# EAGLE design band psd v1.1 shield (EAGLE 7.1.0)
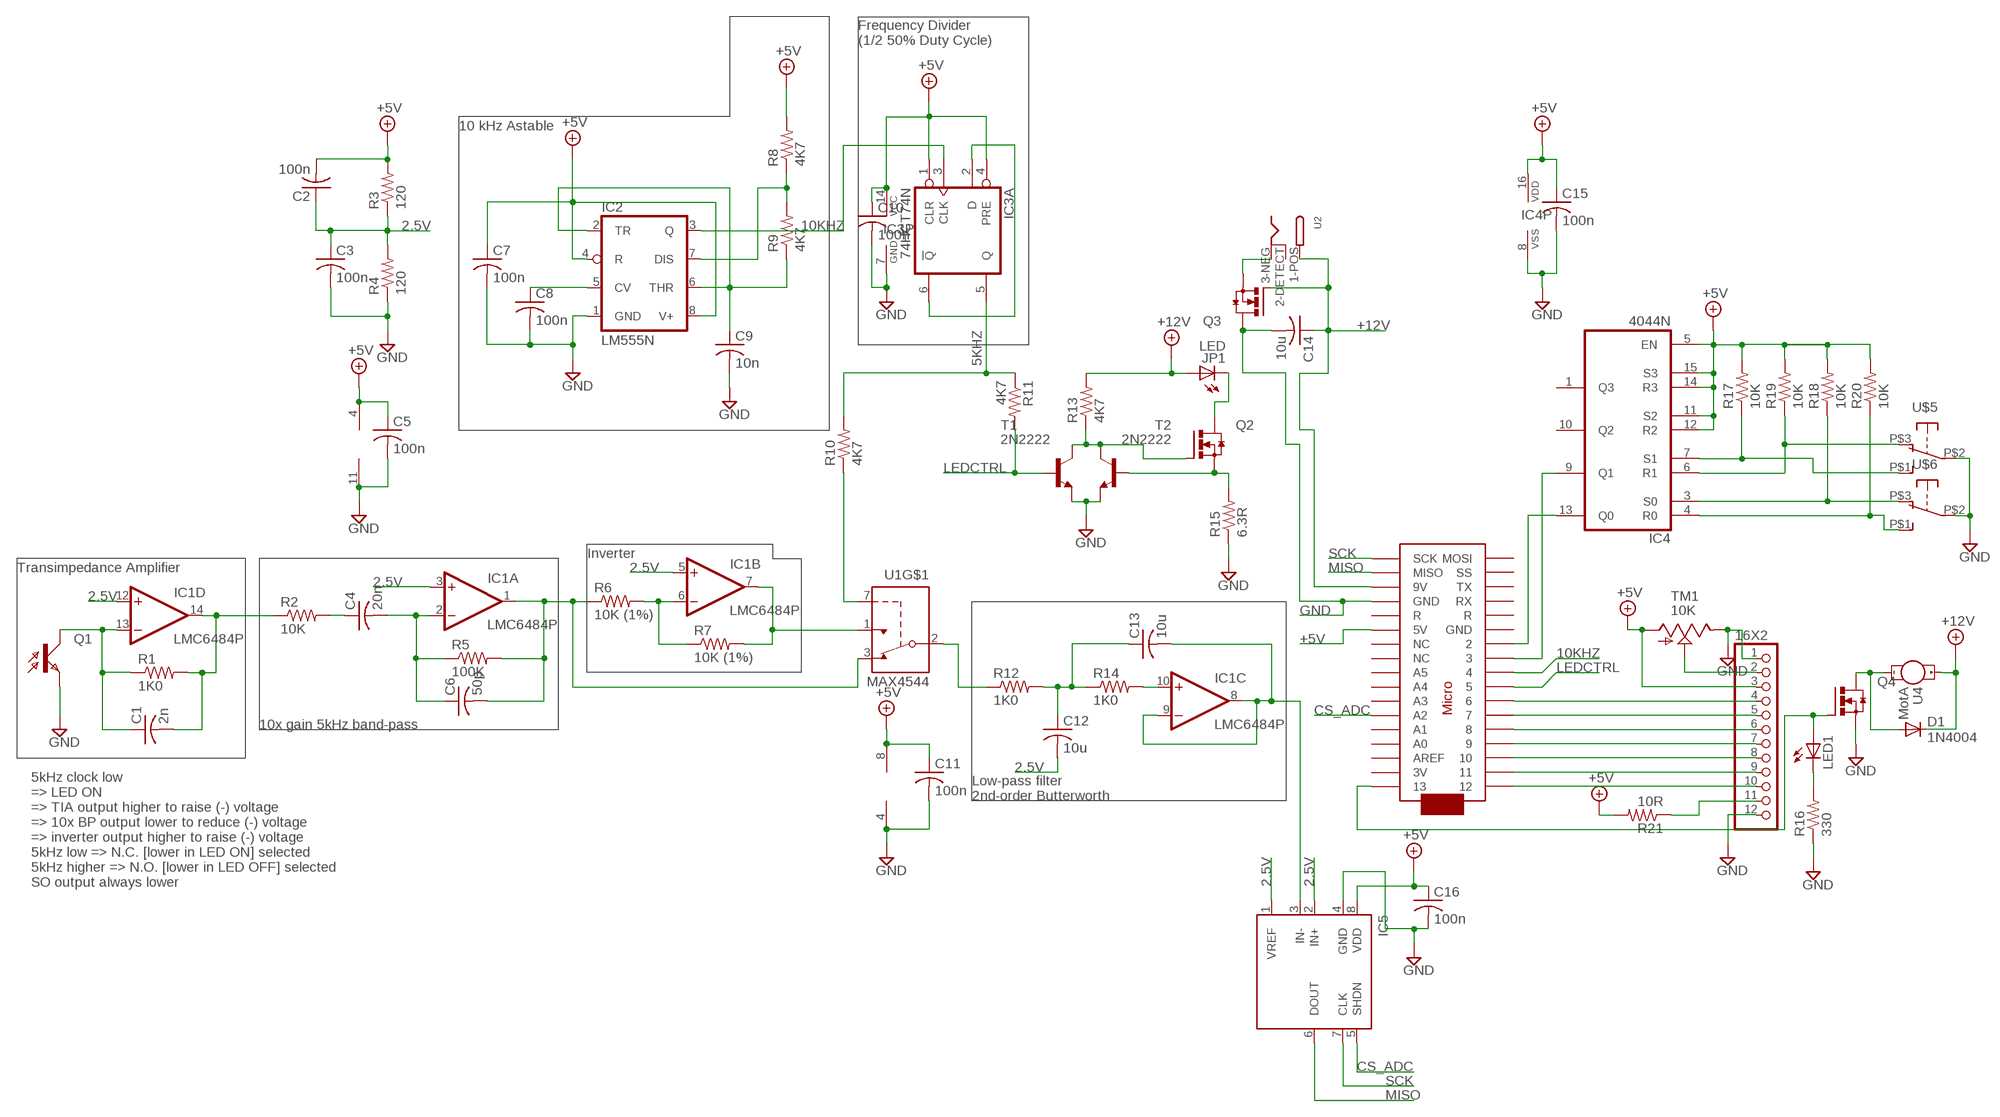
[diagram p0: schematic, sheet 1]

## Parts
16X2  PINHD-1X12-CB  [1X12-CB]
C1  2n  C-US025-025X050  [C025-025X050]
C2  100n  C-US025-025X050  [C025-025X050]
C3  100n  C-US025-025X050  [C025-025X050]
C4  20n  C-US025-025X050  [C025-025X050]
C5  100n  C-US025-025X050  [C025-025X050]
C6  50p  C-US025-025X050  [C025-025X050]
C7  100n  C-US025-025X050  [C025-025X050]
C8  100n  C-US025-025X050  [C025-025X050]
C9  10n  C-US025-025X050  [C025-025X050]
C10  100n  C-US025-025X050  [C025-025X050]
C11  100n  C-US025-025X050  [C025-025X050]
C12  10u  C-US050-025X075  [C050-025X075]
C13  10u  C-US050-025X075  [C050-025X075]
C14  10u  C-US050-050X075  [C050-050X075]
C15  100n  C-US025-025X050  [C025-025X050]
C16  100n  C-US025-025X050  [C025-025X050]
D1  1N4004  [DO41-10]
IC1  LMC6484P  [DIL14]
IC2  LM555N  [DIL08]
IC3  74HCT74N  [DIL14]
IC4  4044N  [DIL16]
IC5  MCP3301  [DIL08]
JP1  LED  LED_CXN  [1X02_SCREW]
LED1  LED3MM  [LED3MM]
Q1  LTR-4206PTRANS  [PTRANS]
Q2  IRLB8721  [TO220BV]
Q3  IRLB8721  [TO220BV]
Q4  IRLB8721  [TO220BV]
R1  1K0  R-US_0204/2V  [0204V]
R2  10K  R-US_0204/2V  [0204V]
R3  120  R-US_0204/2V  [0204V]
R4  120  R-US_0204/2V  [0204V]
R5  100K  R-US_0204/2V  [0204V]
R6  10K (1%)  R-US_0204/2V  [0204V]
R7  10K (1%)  R-US_0204/2V  [0204V]
R8  4K7  R-US_0204/2V  [0204V]
R9  4K7  R-US_0204/2V  [0204V]
R10  4K7  R-US_0204/2V  [0204V]
R11  4K7  R-US_0204/2V  [0204V]
R12  1K0  R-US_0204/2V  [0204V]
R13  4K7  R-US_0204/2V  [0204V]
R14  1K0  R-US_0204/2V  [0204V]
R15  6.3R  R-US_0204/2V  [0204V]
R16  330  R-US_0204/2V  [0204V]
R17  10K  R-US_0204/2V  [0204V]
R18  10K  R-US_0204/2V  [0204V]
R19  10K  R-US_0204/2V  [0204V]
R20  10K  R-US_0204/2V  [0204V]
R21  10R  R-US_0204/2V  [0204V]
T1  2N2222  [TO92-EBC-OVAL]
T2  2N2222  [TO92-EBC-OVAL]
TM1  10K  TRIM_US-B25P  [B25P]
U1  MAX4544  [DIL08]
U2  DC-IN-PANEL  [3WIRES]
U3  ARDUINOMICRO  [ARDUINOMICRO]
U4  MotA  1X02_MOTOR  [1X02_SCREW]
U$5  APE1F-5M-10-Z  [APE1F-5M-10Z]
U$6  APE1F-5M-10-Z  [APE1F-5M-10Z]

## Nets
2.5V: C2.1 C3.1 C12.2 IC1.3(A:+IN) IC1.5(B:+IN) IC1.12(D:+IN) IC5.1(VREF) IC5.2(IN+) R3.1 R4.2
5KHZ: IC3.5(A:Q) R10.2 R11.1
10KHZ: IC2.3(Q) IC3.3(A:CLK) U3.P$9
+5V: 16X2.3 C2.2 C5.1 C7.1 C10.1 C11.1 C15.1 C16.1 IC1.4(P:V+) IC2.4(R) IC2.8(V+) IC3.1(A:CLR) IC3.4(A:PRE) IC3.14(P:VCC) IC4.5(EN) IC4.11(S2) IC4.12(R2) IC4.14(R3) IC4.15(S3) IC4.16(VDD) IC5.8(VDD) R3.2 R8.2 R17.2 R18.2 R19.2 R20.2 R21.2 TM1.A U1.8(V+) U3.P$23(5V)
+12V: C14.1 D1.C JP1.1/POS(A) Q3.G R13.2 U2.1-POS(PWR) U3.P$20(9V) U4.1/POS(+)
CS_ADC: IC5.5(SHDN) U3.P$29(A2)
GND: 16X2.1 16X2.12 C3.2 C5.2 C7.2 C8.2 C9.2 C10.2 C11.2 C14.2 C15.2 C16.2 IC1.11(P:V-) IC2.1(GND) IC3.7(P:GND) IC4.8(VSS) IC5.4(GND) Q1.A(E) Q3.D Q4.S R4.1 R15.1 R16.1 T1.E T2.E TM1.E U1.4(V-) U3.P$12(GND) U$5.P$2(COM) U$6.P$2(COM)
LEDCTRL: R11.2 T1.B U3.P$8
MISO: IC5.6(DOUT) U3.P$19(MISO)
N$1: C1.1 IC1.13(D:-IN) Q1.K(C) R1.1
N$2: C4.1 R2.2
N$3: D1.A Q4.D U4.2(-)
N$4: IC1.6(B:-IN) R6.2 R7.1
N$5: IC1.7(B:OUT) R7.2 U1.1(NO)
N$6: R12.1 U1.2(COM)
N$7: IC1.10(C:+IN) R14.2
N$8: Q2.G R13.1 T1.C T2.C
N$9: C9.1 IC2.2(TR) IC2.6(THR) R9.1
N$10: C8.1 IC2.5(CV)
N$11: 16X2.4 U3.P$7
N$12: IC3.2(A:D) IC3.6(A:!Q)
N$13: IC2.7(DIS) R8.1 R9.2
N$14: Q2.S R15.2 T2.B
N$15: 16X2.5 U3.P$6
N$16: LED1.K(C) R16.2
N$18: JP1.2(K) Q2.D
N$19: LED1.A Q4.G U3.P$34
N$20: 16X2.6 U3.P$5
N$21: 16X2.7 U3.P$4
N$22: C1.2 IC1.14(D:OUT) R1.2 R2.1
N$23: R10.1 U1.7(IN)
N$24: 16X2.8 U3.P$3
N$25: C4.2 C6.1 IC1.2(A:-IN) R5.1
N$26: C6.2 IC1.1(A:OUT) R5.2 R6.1 U1.3(NC)
N$27: C12.1 C13.1 R12.2 R14.1
N$28: C13.2 IC1.8(C:OUT) IC1.9(C:-IN) IC5.3(IN-)
N$29: 16X2.9 U3.P$2
N$30: 16X2.10 U3.P$1
N$31: IC4.9(Q1) U3.P$10
N$32: IC4.13(Q0) U3.P$11
N$33: IC4.7(S1) R17.1 U$5.P$1(NO)
N$34: IC4.6(R1) R19.1 U$5.P$3(NC)
N$36: IC4.3(S0) R18.1 U$6.P$3(NC)
N$37: IC4.4(R0) R20.1 U$6.P$1(NO)
N$38: 16X2.2 TM1.S
N$41: 16X2.11 R21.1
N$47: Q3.S U2.3-NEG(GND)
SCK: IC5.7(CLK) U3.P$18(SCK)
Unconnected: IC3.8(B:!Q) IC3.9(B:Q) IC3.10(B:PRE) IC3.11(B:CLK) IC3.12(B:D) IC3.13(B:CLR) IC4.1(Q3) IC4.10(Q2) U3.P$13(R) U3.P$14(RX) U3.P$15(TX) U3.P$16(SS) U3.P$17(MOSI) U3.P$21(GND) U3.P$22(R) U3.P$24(NC) U3.P$25(NC) U3.P$26(A5) U3.P$27(A4) U3.P$28(A3) U3.P$30(A1) U3.P$31(A0) U3.P$32(AREF) U3.P$33(3V)

## Notes on the sheet
- Frequency Divider
  (1/2 50% Duty Cycle)
- 10 kHz Astable
- Inverter
- Transimpedance Amplifier
- 10x gain 5kHz band-pass
- 5kHz clock low
  => LED ON
  => TIA output higher to raise (-) voltage
  => 10x BP output lower to reduce (-) voltage
  => inverter output higher to raise (-) voltage
  5kHz low => N.C. [lower in LED ON] selected
  5kHz higher => N.O. [lower in LED OFF] selected
  SO output always lower
- Low-pass filter
  2nd-order Butterworth

## Power pins joined to a net without a drawn wire
GNDBREAK: U2.2-DETECT(GNDBREAK)

## Library data of the parts
16X2 = adafruit:PINHD-1X12: PIN HEADER
C1-C16 = adafruit:C-US: CAPACITOR, American symbol
D1 = adafruit:1N4004: DIODE General purpose 1N400x type rectifier (With bigger pads) http://www.ladyada.net/library/pcb/eaglelibrary.html
IC1 = ingolia:LMC6484: SoundPLUS (TM) High Performance AUDIO OPERATIONAL AMPLIFIERS Source: http://focus.ti.com/lit/ds/sbos058/sbos058.pdf
IC2 = linear:*555: TIMER
IC3 = 74xx-eu:74*74: Dual D type positive edge triggered FLIP FLOP, preset and clear
IC4 = 40xx:4044: Quad 3-state NAND R/S LATCH
IC5 = ingolia:MCP3301
JP1 = ingolia:LED_CXN
LED1 = adafruit:LED: LED OSRAM: - CHIPLED LG R971, LG N971, LY N971, LG Q971, LY Q971, LO R971, LY R971 LH N974, LH R974 LS Q976, LO Q976, LY Q976 LO Q996 - Hyper CHIPLED LW Q18S LB Q993, LB Q99A, LB R99A - SideLED LS A670, LO A670, LY A670, LG A670, LP A670 LB A673, LV A673, LT A673, LW A673 LH A674 LY A675 LS A676, LA A676, LO A676, LY A676, LW A676 LS A679, LY A679, LG A679 - Hyper Micro SIDELED® LS Y876, LA Y876, LO Y876, LY Y876 LT Y87S - SmartLED LW L88C, LW L88S LB L89C, LB L89S, LG L890 LS L89K, LO L89K, LY L89K LS L896, LA L896, LO L896, LY L896 - TOPLED LS T670, LO T670, LY T670, LG T670, LP T670 LSG T670, LSP T670, LSY T670, LOP T670, LYG T670 LG T671, LOG T671, LSG T671 LB T673, LV T673, LT T673, LW T673 LH T674 LS T676, LA T676, LO T676, LY T676, LB T676, LH T676, LSB T676, LW T676 LB T67C, LV T67C, LT T67C, LS T67K, LO T67K, LY T67K, LW E67C LS E67B, LA E67B, LO E67B, LY E67B, LB E67C, LV E67C, LT E67C LW T67C LS T679, LY T679, LG T679 LS T770, LO T770, LY T770, LG T770, LP T770 LB T773, LV T773, LT T773, LW T773 LH T774 LS E675, LA E675, LY E675, LS T675 LS T776, LA T776, LO T776, LY T776, LB T776 LHGB T686 LT T68C, LB T68C - Hyper Mini TOPLED® LB M676 - Mini TOPLED Santana® LG M470 LS M47K, LO M47K, LY M47K Source: http://www.osram.convergy.de/
Q1 = ingolia:LTR-4206
Q2-Q4 = ingolia:IRLB8721
R1-R21 = adafruit:R-US_: RESISTOR, American symbol
T1 T2 = adafruit:2N2222: NPN TRANSISTOR Big oval pads
TM1 = pot:TRIM_US-: POTENTIOMETER
U1 = ingolia:MAX4544
U2 = ingolia:DC-IN-PANEL
U3 = adafruit:ARDUINOMICRO
U4 = ingolia:1X02_MOTOR
U$5 U$6 = ingolia:APE1F-5M-10-Z

## Board
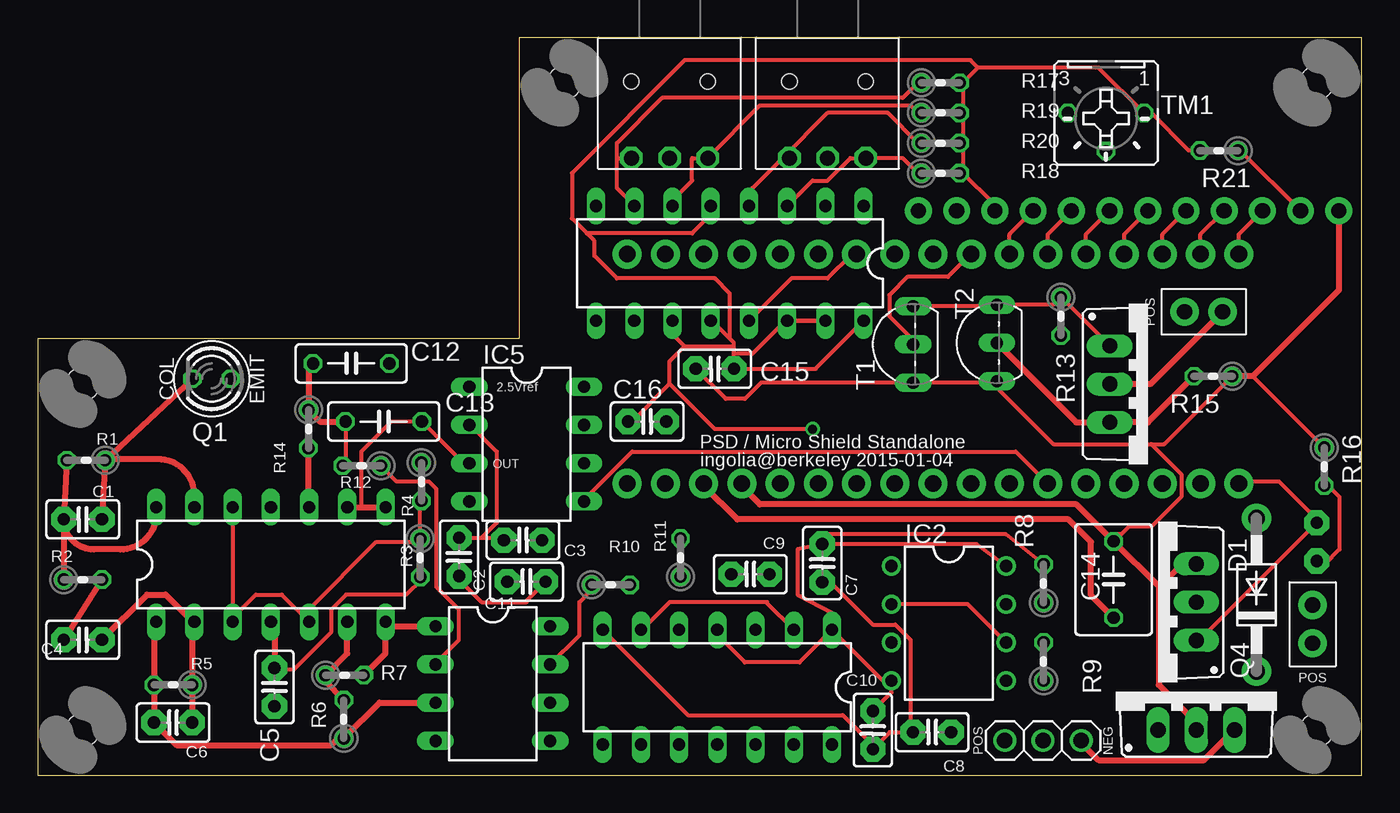
[diagram p1: board, top side]
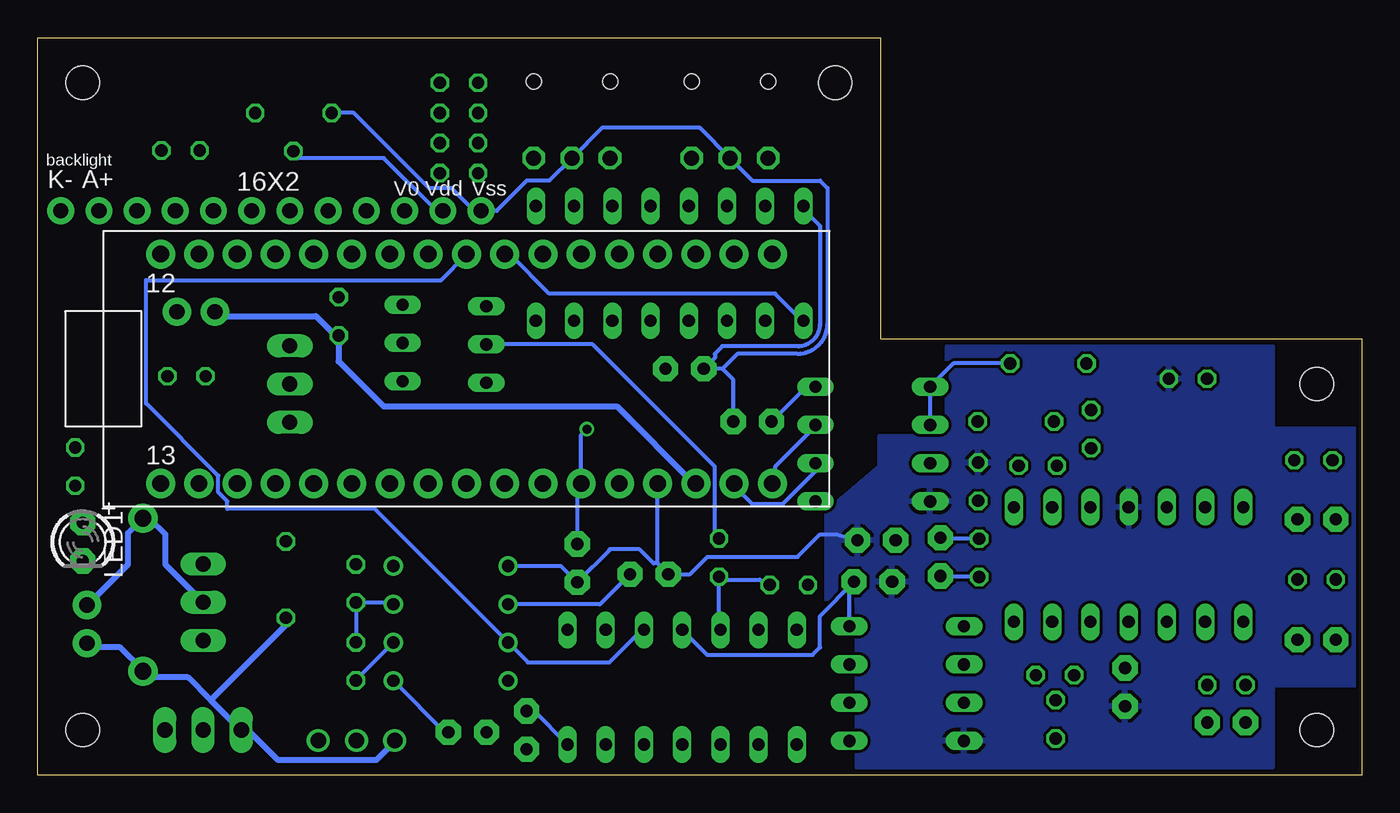
[diagram p2: board, bottom side, seen from below]

Size 88 x 49 mm. Coordinates in mm from the lower left corner, seen from the top.
Outline: 0,0 88,0 88,49 32,49 32,29 0,29 0,0
Copper layers (1*16): Top 0.0356mm / dielectric 1.5011mm / Bottom 0.0356mm
Design rules "OSHPark-LaenPCBOrder": minimum track width 6mil, minimum drill 13mil, track to track 6mil, track to pad 6mil, pad to pad 6mil, via to via 6mil, smd to smd 6mil, copper to edge 15mil, drill to drill 6mil, minimum pad ring 7mil, minimum via ring 7mil, stop-mask expansion 3mil, vias tented up to drill 0mil, thermal gap 10mil
tKeepout: area 6.5,21 to 16.5,29

### Footprints (pad centres in the part's own frame; a part is rotated, then mirrored left to right if it is on the bottom)
1X12-CB = drill 1.016 pad 1.778: 1 -13.97,0; 2 -11.43,0; 3 -8.89,0; 4 -6.35,0; 5 -3.81,0; 6 -1.27,0; 7 1.27,0; 8 3.81,0; 9 6.35,0; 10 8.89,0; 11 11.43,0; 12 13.97,0
C025-025X050 = drill 0.813 pad 1.676 octagon: 1 -1.27,0; 2 1.27,0
C050-025X075 = drill 0.813 octagon: 1 -2.54,0; 2 2.54,0
C050-050X075 = drill 0.813 octagon: 1 -2.54,0; 2 2.54,0
DO41-10 = drill 1.118 pad 1.93: A 5.08,0; C -5.08,0
DIL14 = drill 0.813 long: 1 -7.62,-3.81; 2 -5.08,-3.81; 3 -2.54,-3.81; 4 0,-3.81; 5 2.54,-3.81; 6 5.08,-3.81; 7 7.62,-3.81; 8 7.62,3.81; 9 5.08,3.81; 10 2.54,3.81; 11 0,3.81; 12 -2.54,3.81; 13 -5.08,3.81; 14 -7.62,3.81
DIL08 = drill 0.813 pad 1.27: 1 -3.81,-3.81; 2 -1.27,-3.81; 3 1.27,-3.81; 4 3.81,-3.81; 5 3.81,3.81; 6 1.27,3.81; 7 -1.27,3.81; 8 -3.81,3.81
DIL16 = drill 0.813 long: 1 -8.89,-3.81; 2 -6.35,-3.81; 3 -3.81,-3.81; 4 -1.27,-3.81; 5 1.27,-3.81; 6 3.81,-3.81; 7 6.35,-3.81; 8 8.89,-3.81; 9 8.89,3.81; 10 6.35,3.81; 11 3.81,3.81; 12 1.27,3.81; 13 -1.27,3.81; 14 -3.81,3.81; 15 -6.35,3.81; 16 -8.89,3.81
DIL08' = drill 0.813 long: 1 -3.81,-3.81; 2 -1.27,-3.81; 3 1.27,-3.81; 4 3.81,-3.81; 5 3.81,3.81; 6 1.27,3.81; 7 -1.27,3.81; 8 -3.81,3.81
1X02_SCREW = drill 1.016 pad 1.88: 1/POS 1.27,1.27; 2 3.81,1.27
LED3MM = drill 0.813 pad 1.676 octagon: A -1.27,0; K 1.27,0
PTRANS = drill 0.813 octagon: A -1.27,0; K 1.27,0
TO220BV = drill 1.016 long: D 0,0; G -2.54,0; S 2.54,0
0204V = drill 0.813 octagon: 1 -1.27,0; 2 1.27,0
TO92-EBC-OVAL = drill 0.813 long: B 0,-1.27; C 2.54,-1.27; E -2.54,-1.27
B25P = drill 0.813 octagon: A -2.54,0; E 2.54,0; S 0,2.54
3WIRES = drill 1.016: 1-POS 1.27,3.81; 2-DETECT 3.81,3.81; 3-NEG 6.35,3.81
ARDUINOMICRO = drill 1.1 pad 1.93: P$1 -20.32,7.62; P$2 -17.78,7.62; P$3 -15.24,7.62; P$4 -12.7,7.62; P$5 -10.16,7.62; P$6 -7.62,7.62; P$7 -5.08,7.62; P$8 -2.54,7.62; P$9 0,7.62; P$10 2.54,7.62; P$11 5.08,7.62; P$12 12.7,-7.62; P$13 10.16,-7.62; P$14 12.7,7.62; P$15 15.24,7.62; P$16 17.78,7.62; P$17 20.32,7.62; P$18 20.32,-7.62; P$19 17.78,-7.62; P$20 15.24,-7.62; P$21 7.62,7.62; P$22 10.16,7.62; P$23 7.62,-7.62; P$24 5.08,-7.62; P$25 2.54,-7.62; P$26 0,-7.62; P$27 -2.54,-7.62; P$28 -5.08,-7.62; P$29 -7.62,-7.62; P$30 -10.16,-7.62; P$31 -12.7,-7.62; P$32 -15.24,-7.62; P$33 -17.78,-7.62; P$34 -20.32,-7.62
M2MOUNT = hole 2.2: 0,0
APE1F-5M-10Z = drill 1 octagon: P$1 -2.54,0; P$2 0,0; P$3 2.54,0 | hole 1: -2.54,5.08; 2.54,5.08

### Placement (x,y rotation side)
16X2  72.5,37.5 0 top
C1  3,17 180 top
C2  28,14.5 270 top
C3  32.25,15.62 0 top
C4  3,9 0 top
C5  15.74,5.86 270 top
C6  9,3.5 180 top
C7  52.14,14.09 270 top
C8  59.44,2.86 180 top
C9  47.36,13.36 180 top
C10  55.5,3 270 top
C11  32.49,12.86 180 top
C12  20.84,27.36 0 top
C13  23,23.5 0 top
C14  71.5,13 90 top
C15  45,27 180 top
C16  40.5,23.5 0 top
D1  81,12 90 top
IC1  15.5,14 0 top
IC2  60.55,10.09 270 top
IC3  45.17,5.85 180 top
IC4  46,34 180 top
IC5  [DIL08']  32.5,22 270 top
JP1  74.94,29.52 0 top
LED1  85,15.5 270 bottom
Q1  11.56,26.34 180 top
Q2  71.25,25.99 270 top
Q3  77,3 0 top
Q4  77,11.5 90 top
R1  3.22,20.93 180 top
R2  3,13 0 top
R3  25.43,14.44 270 top
R4  25.5,19.5 270 top
R5  9,6 180 top
R6  20.35,3.72 90 top
R7  20.4,6.65 0 top
R8  66.85,12.74 90 top
R9  66.85,7.56 90 top
R10  38.08,12.65 0 top
R11  42.72,14.46 90 top
R12  21.54,20.56 180 top
R13  67.99,30.49 270 top
R14  18,23 270 top
R15  78.11,26.51 180 top
R16  85.5,20.5 270 top
R17  60,46 0 top
R18  60,40 0 top
R19  60,44 0 top
R20  60,42 0 top
R21  78.5,41.5 180 top
T1  56.91,28.62 90 top
T2  62.48,28.72 90 top
TM1  71,44 180 top
U1  MAX4544  [DIL08']  30.25,6.09 270 top
U2  63,-1.5 0 top
U3  59.5,27 0 bottom
U4  86,7.5 90 top
U$1  [M2MOUNT]  3,3 0 top
U$2  [M2MOUNT]  85,46 0 top
U$3  [M2MOUNT]  85,3 0 top
U$4  [M2MOUNT]  3,26 0 top
U$5  42,41 0 top
U$6  52.5,41 0 top
U$7  [M2MOUNT]  35,46 0 top

### Tracks (layer width: path | path; a pad name or v marks a point on that pad's centre or on a via)
2.5V
  Top 0.254: IC1.12 IC1.3 12.96,10.46 14.5,12 16.23,12 IC1.5 18.04,11.04 22.5,15.5 25.22,15.5 R3.1 25.43,18.16 R4.2 | C2.1 29.5,15.77 | 29.5,15.77 30.83,15.77 C3.1 | IC5.2 28.73,23.27 30.5,21.5 30.5,16.77 29.5,15.77
  Bottom 0.254: C12.2 27.14,27.36 IC5.1 IC5.2 | R3.1 27.94,15.71 C2.1
5KHZ
  Bottom 0.254: IC3.5 42.72,9.75 R11.1 42.53,13 40,13 39.65,12.65 R10.2
10KHZ
  Bottom 0.254: IC3.3 47.84,9.66 50,7.5 55.42,7.5 IC2.3 56.8,8.9 65.6,17.7 75.4,17.7 75.4,18.2 76,18.8 76,19.9 80.8,24.7 80.8,32.9 61.2,32.9 59.5,34.6 U3.P$9
+5V  (via drill 0.6)
  Top 0.254: R3.2 25.5,13 24.5,12 20.5,12 19.5,11 19.5,9.5 17,7 15.87,7 C5.1 | C10.1 56.74,5.51 IC2.4 56.17,6.28 IC3.1 | C7.1 50.5,15 50.5,12 52.79,10.79 IC3.1 | IC3.1 50.63,7.5 47,7.5 45.17,9.33 IC3.4 | IC2.8 62.4,15.36 C7.1 | R8.2 64.36,16 52.5,16 52.36,15.86 C7.1 | IC4.16 51.7,27 C15.1 46.27,28 | 46.27,28 46.27,28.5 | 46.27,28.5 46.27,28.73 46,29 | 46,29 46,32 45,33 38.5,33 37,34.5 37,35.5 36.5,36 | IC4.5 44.73,37.23 43.5,36 36.5,36 | v51.5,23 45,23 42,26 | 42,26 42,27.5 43,28.5 | 43,28.5 46.27,28.5 | 61.5,46 61.5,44 | 61.5,44 61.5,42 | 61.5,44 R19.2 | 61.5,42 61.5,40 | 61.5,42 R20.2 | 61.5,40 63.5,38 63.5,37.5 16X2.3 | 61.5,40 R18.2 | 62.5,47 70.5,47 73.5,44 TM1.A 74,44 76.5,41.5 R21.2 | 61.5,46 R17.2 | 62.5,47 62,47.5 43,47.5 35.5,40 35.5,37 36.5,36 | 61.5,46 62.5,47 | IC4.11 42.19,29.31 43,28.5 | IC4.12 44.81,30.19 46,29 | IC4.14 IC4.15 49.69,30.19 47.5,28 46.27,28 | C11.1 32.5,11.6 32.5,11.5 29.5,11.5 28,13 C2.2 | C16.1 39.5,23.5 42,26
  Top 0.406: C5.1 15.74,9.95 IC1.4 15.5,10.5
  Bottom 0.254: IC3.4 43.51,8 36.5,8 36,8.5 36,10.58 C11.1 34.06,12.56 U1.8 | IC3.14 55.02,4.27 C10.1 | C7.1 52.14,19.12 U3.P$23 51.88,22.62 v51.5,23 | 16X2.3 63.5,37.5 | C2.2 25.49,13.23 R3.2 | IC5.8 36.92,25.81 C16.1
+12V
  Top 0.406: C14.1 70,11.96 70,15.5 68.5,17 46.5,17 44.26,19.24 U3.P$20
  Bottom 0.406: U2.1-POS 64.5,2 65.5,1 72,1 74,3 Q3.G 74.5,3 76.5,5 | 76.5,5 78,6.5 81,6.5 D1.C 81,7 82.5,8.5 84.5,8.5 U4.1/POS | 76.5,5 71.5,10 C14.1 | U3.P$20 44.38,19.38 49.5,24.5 65,24.5 68,27.5 R13.2 68.22,29.22 69.5,30.5 75.92,30.5 JP1.1/POS
CS_ADC
  Top 0.254: IC5.5 36.5,18.5 39.5,21.5 65,21.5 U3.P$29
GND
  Top 0.254: R16.1 80.76,26.51 | IC3.7 43.21,4 53.5,4 55.5,2 C10.2 56.63,2.86 C8.2 58,3.03 58,9 57,10 55.5,10 52.68,12.82 C7.2 | C15.2 45.73,25 47,25 48.08,26.08 T1.E 63.5,26.08 | 74,22 67.5,22 63.65,25.85 63.65,26.08 63.5,26.08 | 74,22 74.87,22 R15.1 | 74,22 76,20 76,18.5 74,16.5 72.5,16.5 72,16 71.5,16 C14.2 | T2.E 63.5,26 63.5,26.08
  Top 0.406: 74.5,12.54 C14.2 69.04,18 48,18 46.8,19.2 U3.P$12 | 74.5,12.54 74.5,6 77,3.5 Q3.D | Q4.S 76.96,14 76,14 74.54,12.54 74.5,12.54 | R15.1 80.76,26.51 86.47,32.22 16X2.12
  Bottom 0.254: C8.2 58,3.03 | IC2.1 53.22,13.9 C7.2 50,14.96 50,15 48,15 47.07,14.07 46.8,14.07 | 46.8,14.07 U3.P$12 | 46.8,14.07 C9.2 44.64,13.36 43.5,14.5 37.5,14.5 36,16 34.9,16 C3.2 | IC4.8 37,37.5 36,36.5 36,30 arc90 37.5,28.5 42.5,28.5 43,28 43,27.73 43.37,27.37 | TM1.E 67,44 62,39 60.5,39 59,37.5 16X2.1 57.5,37.5 55.5,39.5 54,39.5 U$6.P$2 50.5,43 44,43 U$5.P$2 40.5,39.5 36,39.5 35.5,39 35.5,30 arc90 37.5,28 41.5,28 42.5,27 | 43.37,27.37 C15.2 | 42.5,27 43,27 43.37,27.37 | C16.2 41.77,26.27 42.5,27
  pour Bottom (isolate 0.2): 6,28.5 6,23 0.5,23 0.5,6 6,6 6,0.5 33.5,0.5 33.5,11.5 35.5,11.5 35.5,17.5 32,20.5 32,22.5 27.5,22.5 27.5,28.5
LEDCTRL
  Top 0.254: U3.P$8 62,34.6 60.5,33.1 57.8,33.1 56.6,31.9 56.6,30.5 58.1,29 58.1,28.7 T1.B
  Bottom 0.254: R11.2 43,16.01 43,20.5 51.12,28.62 T1.B 58.5,29
MISO
  Bottom 0.254: U3.P$19 41.5,19 40.5,18 38.5,18 36,20.5 IC5.6
N$1
  Top 0.406: Q1.K R1.1 | R1.1 C1.1 | IC1.13 10.42,18.58 arc90 8,21 4.56,21 arc90 R1.1
N$2
  Top 0.406: R2.2 C4.1
N$3
  Bottom 0.406: 84.5,11.5 U4.2 84.69,11.31 82,14 82,16.08 D1.A 80.58,17.08 79.5,16 79.5,14 Q4.D
N$4
  Top 0.406: R6.2 19.13,6.21 R7.1 20.58,8.1 IC1.6
N$5
  Top 0.406: R7.2 23.12,8.1 IC1.7 23.41,9.9 U1.1
N$6
  Top 0.254: U1.2 26.44,7.44 28,9 28,11 26.5,12.5 26.5,19 26,19.5 23.87,19.5 R12.1
N$7
  Top 0.406: IC1.10 18,17.85 R14.2
N$8
  Top 0.254: Q2.G 68.02,31.76 R13.1 67.49,31.26 T2.C 63.65,31.16 T1.C
N$9
  Top 0.254: IC2.6 61.82,11.36 IC2.2
  Bottom 0.254: IC2.6 66.85,6.33 R9.1 | C9.1 50.63,11.36 IC2.2
N$10
  Bottom 0.254: IC2.5 60.94,2.86 C8.1
N$11
  Top 0.254: U3.P$7 64.58,35.93 16X2.4
N$12
  Top 0.254: IC3.2 48.5,11.41 48.5,11.5 42,11.5 40.16,9.66 IC3.6
N$13
  Bottom 0.254: IC2.7 64.47,11.47 R8.1 R9.2
N$14
  Top 0.406: T2.B 69.02,23.45 Q2.S 73.78,23.45 R15.2
N$15
  Top 0.254: U3.P$6 67.12,35.93 16X2.5
N$16
  Top 0.254: R16.2 85.77,19.23 86.5,18.5 86.5,15 85.5,14 85.23,14 LED1.K
N$18
  Top 0.406: JP1.2 73.95,25.99 Q2.D
N$19
  Top 0.254: U3.P$34 79.94,19.5 82.5,19.5 85,17 LED1.A 77.19,8.96 Q4.G
N$20
  Top 0.254: U3.P$5 69.66,35.93 16X2.6
N$21
  Top 0.254: U3.P$4 72.2,35.93 16X2.7
N$22
  Top 0.406: IC1.14 7.88,17.38 arc-90 5.5,15 3.73,15 arc-90 C1.2 | R1.2 C1.2 | C1.2 R2.1
N$23
  Top 0.254: U1.7 36,9.3 36,11.5 36.81,12.31 R10.1
N$24
  Top 0.254: U3.P$3 74.74,35.93 16X2.8
N$25
  Top 0.406: C4.2 7.27,12 8.5,12 10.31,10.19 IC1.2 10.27,10.04 R5.1 C6.1
N$26
  Top 0.406: IC1.1 7.73,10.04 R5.2 C6.2 9.23,2 19.5,2 19.95,2.45 R6.1 22.72,4.82 U1.3
N$27
  Top 0.254: C13.1 20.5,23.5 20.5,21 R12.2
  Top 0.406: C13.1 18.77,23.5 R14.1 18,27.06 C12.1
N$28
  Top 0.254: 21.5,17.81 21.5,21.5 23.5,23.5 C13.2 28.31,20.73 IC5.3
  Top 0.406: IC1.9 21.5,17.81 IC1.8
N$29
  Top 0.254: U3.P$2 77.28,35.93 16X2.9
N$30
  Top 0.254: U3.P$1 79.82,35.93 16X2.10
N$31
  Bottom 0.254: U3.P$10 56.5,34.5 54,32 39,32 37.5,30.5 IC4.9
N$32
  Top 0.254: U3.P$11 54.12,34.62 52.5,33 50.08,33 IC4.13
N$33
  Top 0.254: R17.1 58.5,46 57.5,45 41.5,45 38.5,42 38.5,41 | 38.5,41 38.5,39 39.5,38 IC4.7 | 38.5,41 U$5.P$1
N$34
  Top 0.254: 44.5,41 43.5,41 43.5,39.5 42,38 IC4.6 | 44.5,41 48,44.5 58,44.5 58.5,44 R19.1 | 44.5,41 U$5.P$3
N$36
  Top 0.254: R18.1 58.5,40 57.5,41 U$6.P$3 54,41 52.5,39.5 51.5,39.5 IC4.3
N$37
  Top 0.254: 49.5,41 47.5,39 47.5,38 IC4.4 | R20.1 58.5,42 56.5,44 52.5,44 49.5,41 | 49.5,41 U$6.P$1
N$38
  Bottom 0.254: 16X2.2 61.5,37.5 65,41 71,41 TM1.S
N$41
  Top 0.254: R21.1 79.93,41.5 16X2.11
N$47
  Top 0.406: Q3.S 79.5,3 77.5,1 70.5,1 69.5,2 U2.3-NEG
SCK
  Bottom 0.254: U3.P$18 39,19.5 39,20.5 36.5,23 IC5.7

### Text on the board
tPlace: 2.5Vref | OUT | PSD / Micro Shield Standalone / ingolia@berkeley 2015-01-04
bPlace: backlight | A+ | K- | Vss | Vdd | V0